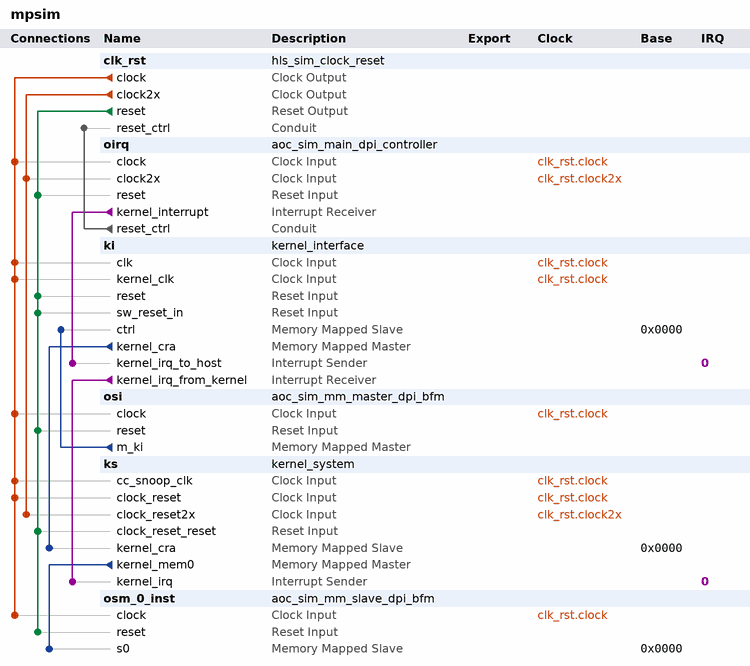
[diagram p0: system contents]
# Platform Designer (Qsys) system mpsim, Arria 10 10AS016C3U19E2LG
# Parameters at their usual value, and those the tool derives, are not listed.
package require -exact qsys 1.0
create_system mpsim
set_project_property DEVICE_FAMILY {Arria 10}
set_project_property DEVICE 10AS016C3U19E2LG

add_component clk_rst ip/mpsim/mpsim_clk_rst.ip hls_sim_clock_reset clk_rst 1.0

add_component oirq ip/mpsim/mpsim_oirq.ip aoc_sim_main_dpi_controller oirq 1.0

add_component ki ip/mpsim/mpsim_ki.ip kernel_interface ki 15.1

add_component osi ip/mpsim/mpsim_osi.ip aoc_sim_mm_master_dpi_bfm osi 1.0

add_component ks kernel_system.qsys kernel_system ks 

add_component osm_0_inst ip/mpsim/mm_slave_ks_kernel_mem0.ip aoc_sim_mm_slave_dpi_bfm osm_0_inst 1.0

# connections
add_connection clk_rst.clock ki.clk clock
add_connection clk_rst.clock ki.kernel_clk clock
add_connection clk_rst.clock ks.cc_snoop_clk clock
add_connection clk_rst.clock ks.clock_reset clock
add_connection clk_rst.clock oirq.clock clock
add_connection clk_rst.clock osi.clock clock
add_connection clk_rst.clock osm_0_inst.clock clock
add_connection clk_rst.clock2x ks.clock_reset2x clock
add_connection clk_rst.clock2x oirq.clock2x clock
add_connection clk_rst.reset ki.reset reset
add_connection clk_rst.reset ki.sw_reset_in reset
add_connection clk_rst.reset ks.clock_reset_reset reset
add_connection clk_rst.reset oirq.reset reset
add_connection clk_rst.reset osi.reset reset
add_connection clk_rst.reset osm_0_inst.reset reset
add_connection ki.kernel_cra ks.kernel_cra avalon
set_connection_parameter_value ki.kernel_cra/ks.kernel_cra baseAddress 0x0000
add_connection ks.kernel_mem0 osm_0_inst.s0 avalon
set_connection_parameter_value ks.kernel_mem0/osm_0_inst.s0 baseAddress 0x0000
add_connection osi.m_ki ki.ctrl avalon
set_connection_parameter_value osi.m_ki/ki.ctrl baseAddress 0x0000
add_connection oirq.reset_ctrl clk_rst.reset_ctrl conduit
add_connection ki.kernel_irq_from_kernel ks.kernel_irq interrupt
set_connection_parameter_value ki.kernel_irq_from_kernel/ks.kernel_irq irqNumber 0
add_connection oirq.kernel_interrupt ki.kernel_irq_to_host interrupt
set_connection_parameter_value oirq.kernel_interrupt/ki.kernel_irq_to_host irqNumber 0

save_system mpsim.qsys
